# Altium schematic sheet Keypad.SchDoc
size Letter; SheetNumber: 9; SheetTotal: 11
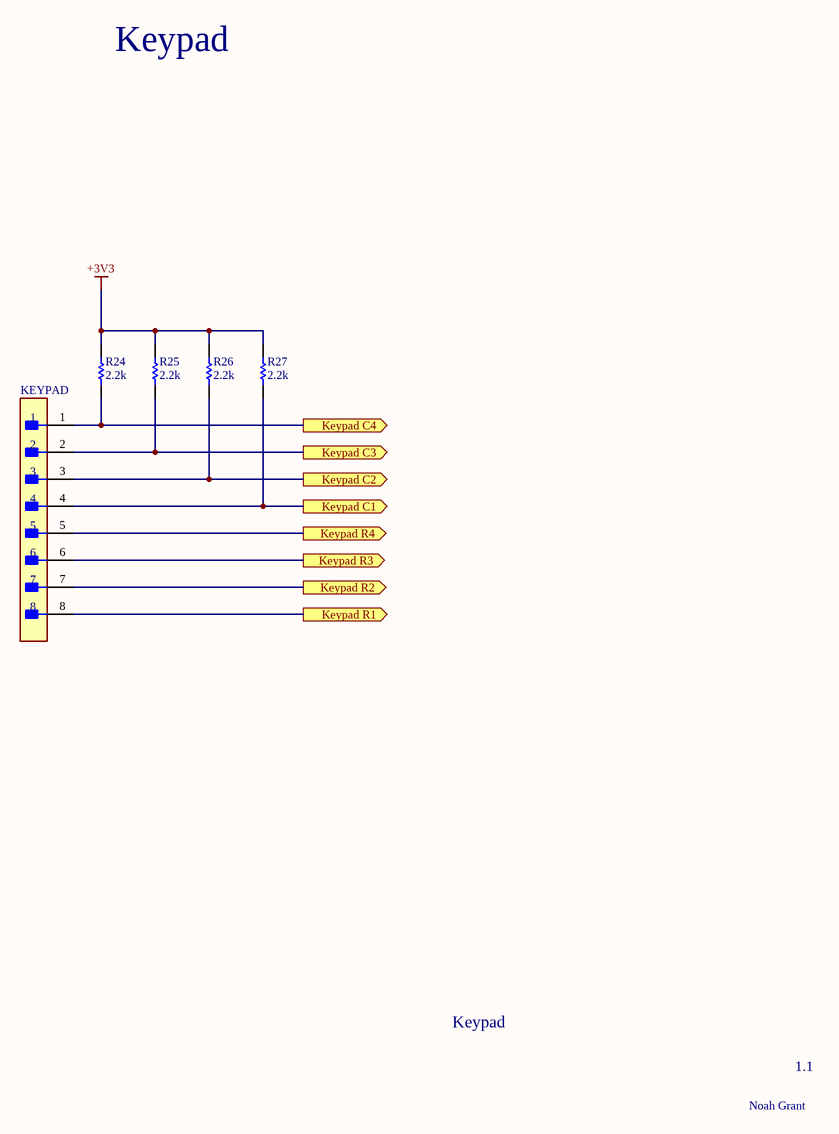
[diagram p0: Keypad.SchDoc]

## Parts
KEYPAD  TSW-108-08-G-S  [FP-TSW-108-08-G-S-MFG]  (value not drawn)
R24  2.2k  [RESC1609X50X30NL10T20]
R25  2.2k  [RESC1609X50X30NL10T20]
R26  2.2k  [RESC1609X50X30NL10T20]
R27  2.2k  [RESC1609X50X30NL10T20]

## Ports
Keypad C1 (out, see Top_Sheet[1C], Nucleo[3C]), Keypad C2 (out, see Top_Sheet[1C], Nucleo[3C]), Keypad C3 (out, see Top_Sheet[1C], Nucleo[3C]), Keypad C4 (out, see Top_Sheet[1C], Nucleo[1C]), Keypad R1 (out, see Top_Sheet[1C], Nucleo[2C]), Keypad R2 (out, see Top_Sheet[1C], Nucleo[4C]), Keypad R3 (out, see Top_Sheet[1C], Nucleo[4C]), Keypad R4 (out, see Top_Sheet[1C], Nucleo[3C])

## Nets
+3V3: R24.2 R25.2 R26.2 R27.2
Keypad C1: KEYPAD.4 R27.1 ; port Keypad C1
Keypad C2: KEYPAD.3 R26.1 ; port Keypad C2
Keypad C3: KEYPAD.2 R25.1 ; port Keypad C3
Keypad C4: KEYPAD.1 R24.1 ; port Keypad C4
Keypad R1: KEYPAD.8 ; port Keypad R1
Keypad R2: KEYPAD.7 ; port Keypad R2
Keypad R3: KEYPAD.6 ; port Keypad R3
Keypad R4: KEYPAD.5 ; port Keypad R4

## Notes on the sheet
- Keypad
- 1.1
- Noah Grant

## Library data of the parts
KEYPAD = CMP-02766-000001-1: CONN HEADER VERT 8POS 2.54MM; Manufacturer: Samtec; Number Of Contacts: 8; Conn Orientation: Straight; Conn Gender: Male; Device Class L1: Connectors; ComponentLink2Description: Datasheet; Digikey Description: CONN HEADER VERT 8POS 2.54MM; ComponentLink2URL: http://suddendocs.samtec.com/catalog_english/tsw_th.pdf; Temperature: -55°C to +125°C; RoHS: TRUE; Mouser Description: TSW - Samtec 2.54mm Pin Header 13.46mm Overall Pin Length 5.08mm Tail; Automotive: No; Temperature Range High: +125°C; Package: TSW-108-08-G-S; Device Class L3: unset; Manufacturer Part Number: TSW-108-08-G-S; Pitch: 2.54mm; Number Of Rows: 1; Lead Free: Yes; Height: 8.71mm; Contact Material: Gold,Nickel; Footprint Url: http://suddendocs.samtec.com/prints/tsw-xxx-xx-x-x-xx-xxx-footprint.pdf; Temperature Range Low: -55°C; Octopart: https://octopart.com/tsw-108-08-g-s-samtec-272653; Category: Conn; Device Class L2: Headers and Wire Housings
R24-R27 = CMP-2000-03167-1: 0603; Part Number: CRCW06032K20FKEA; Manufacturer: Vishay Dale